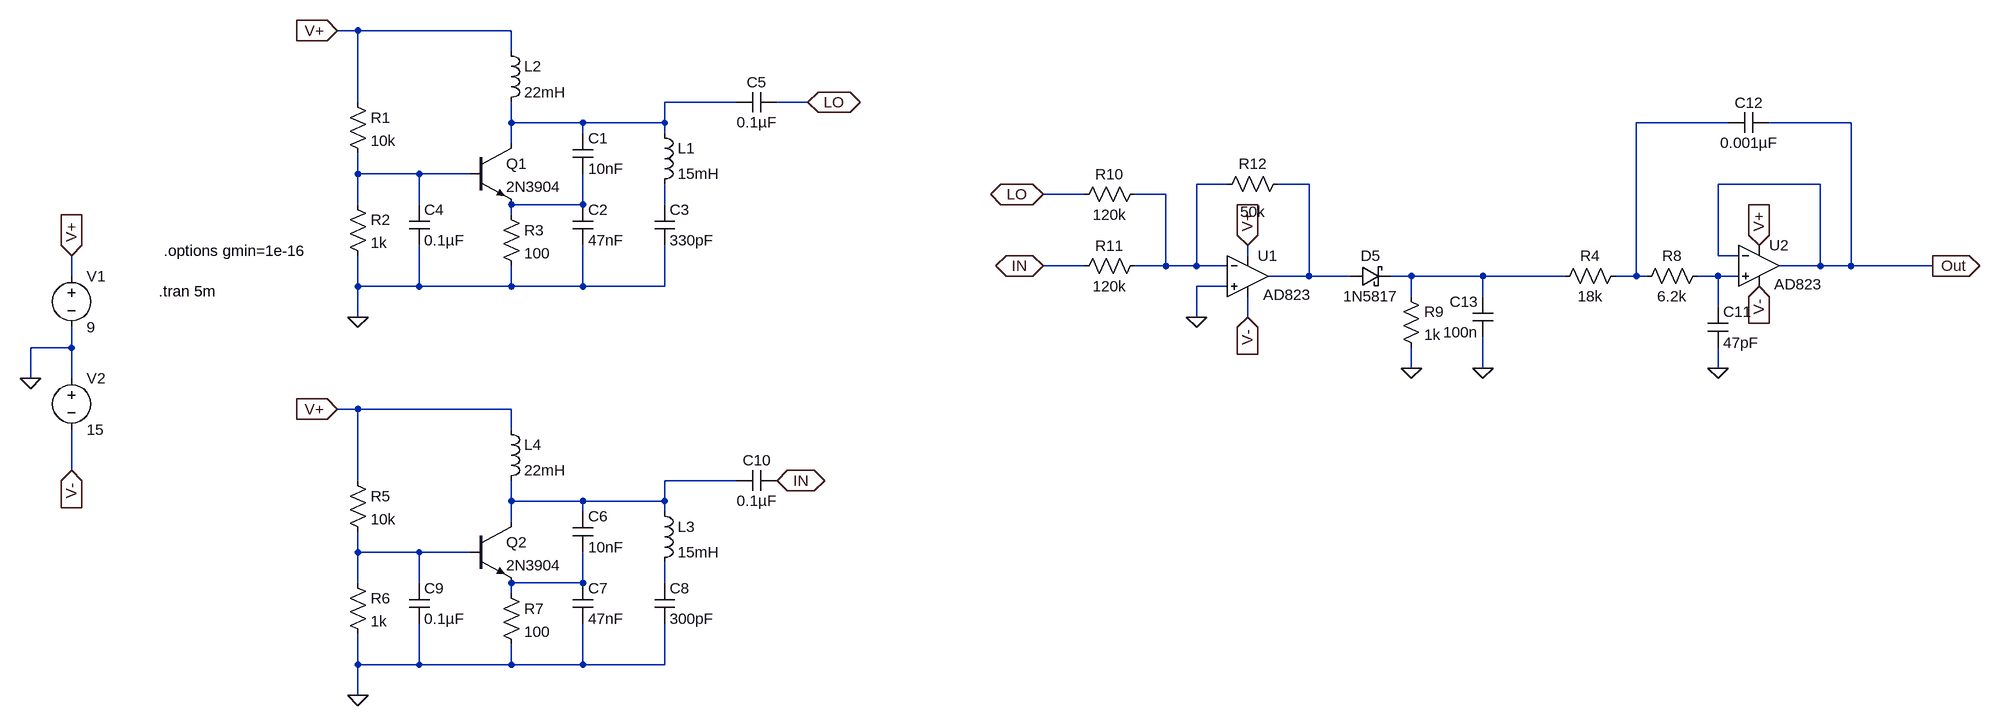
[diagram p0: schematic Draft3.asc]
Draft3.asc, the LTspice schematic file:
Version 4
SHEET 1 4036 1492
WIRE 432 64 400 64
WIRE 672 64 432 64
WIRE 672 96 672 64
WIRE 432 176 432 64
WIRE 1024 176 912 176
WIRE 1136 176 1088 176
WIRE 672 208 672 176
WIRE 784 208 672 208
WIRE 912 208 912 176
WIRE 912 208 784 208
WIRE 2576 208 2432 208
WIRE 2768 208 2640 208
WIRE 784 224 784 208
WIRE 912 224 912 208
WIRE 672 240 672 208
WIRE 432 288 432 256
WIRE 528 288 432 288
WIRE 608 288 528 288
WIRE 1792 304 1744 304
WIRE 1920 304 1872 304
WIRE 2720 304 2560 304
WIRE 1568 320 1504 320
WIRE 1696 320 1648 320
WIRE 432 336 432 288
WIRE 528 336 528 288
WIRE 784 336 784 288
WIRE 784 336 672 336
WIRE 912 336 912 304
WIRE 672 352 672 336
WIRE 1824 416 1824 400
WIRE 2560 416 2560 304
WIRE 2592 416 2560 416
WIRE 1568 432 1504 432
WIRE 1696 432 1696 320
WIRE 1696 432 1648 432
WIRE 1744 432 1744 304
WIRE 1744 432 1696 432
WIRE 1792 432 1744 432
WIRE 2720 432 2720 304
WIRE 2720 432 2656 432
WIRE 2768 432 2768 208
WIRE 2768 432 2720 432
WIRE 2896 432 2768 432
WIRE -16 448 -16 416
WIRE 1920 448 1920 304
WIRE 1920 448 1856 448
WIRE 1984 448 1920 448
WIRE 2080 448 2048 448
WIRE 2192 448 2080 448
WIRE 2320 448 2192 448
WIRE 2432 448 2432 208
WIRE 2432 448 2400 448
WIRE 2448 448 2432 448
WIRE 2560 448 2528 448
WIRE 2592 448 2560 448
WIRE 432 464 432 416
WIRE 528 464 528 400
WIRE 528 464 432 464
WIRE 672 464 672 432
WIRE 672 464 528 464
WIRE 784 464 784 400
WIRE 784 464 672 464
WIRE 912 464 912 400
WIRE 912 464 784 464
WIRE 1792 464 1744 464
WIRE 2080 480 2080 448
WIRE 2192 480 2192 448
WIRE 2560 496 2560 448
WIRE 432 512 432 464
WIRE 1744 512 1744 464
WIRE 1824 512 1824 480
WIRE -16 560 -16 528
WIRE -16 560 -80 560
WIRE 2080 592 2080 560
WIRE 2192 592 2192 544
WIRE 2560 592 2560 560
WIRE -80 608 -80 560
WIRE -16 608 -16 560
WIRE 432 656 400 656
WIRE 672 656 432 656
WIRE 672 688 672 656
WIRE -16 752 -16 688
WIRE 432 768 432 656
WIRE 1024 768 912 768
WIRE 672 800 672 768
WIRE 784 800 672 800
WIRE 912 800 912 768
WIRE 912 800 784 800
WIRE 784 816 784 800
WIRE 912 816 912 800
WIRE 672 832 672 800
WIRE 432 880 432 848
WIRE 528 880 432 880
WIRE 608 880 528 880
WIRE 432 928 432 880
WIRE 528 928 528 880
WIRE 784 928 784 880
WIRE 784 928 672 928
WIRE 912 928 912 896
WIRE 672 944 672 928
WIRE 432 1056 432 1008
WIRE 528 1056 528 992
WIRE 528 1056 432 1056
WIRE 672 1056 672 1024
WIRE 672 1056 528 1056
WIRE 784 1056 784 992
WIRE 784 1056 672 1056
WIRE 912 1056 912 992
WIRE 912 1056 784 1056
WIRE 432 1104 432 1056
FLAG 432 512 0
FLAG 432 1104 0
FLAG -16 416 V+
IOPIN -16 416 In
FLAG 400 64 V+
IOPIN 400 64 In
FLAG 400 656 V+
IOPIN 400 656 In
FLAG 1504 320 LO
IOPIN 1504 320 BiDir
FLAG 1136 176 LO
IOPIN 1136 176 BiDir
FLAG 1088 768 IN
IOPIN 1088 768 BiDir
FLAG 1504 432 IN
IOPIN 1504 432 BiDir
FLAG 2896 432 Out
IOPIN 2896 432 Out
FLAG -80 608 0
FLAG -16 752 V-
IOPIN -16 752 In
FLAG 1824 512 V-
IOPIN 1824 512 In
FLAG 1824 400 V+
IOPIN 1824 400 In
FLAG 1744 512 0
FLAG 2560 592 0
FLAG 2624 400 V+
IOPIN 2624 400 In
FLAG 2624 464 V-
IOPIN 2624 464 In
FLAG 2080 592 0
FLAG 2192 592 0
SYMBOL res 416 160 R0
SYMATTR InstName R1
SYMATTR Value 10k
SYMBOL res 416 320 R0
SYMATTR InstName R2
SYMATTR Value 1k
SYMBOL npn 608 240 R0
SYMATTR InstName Q1
SYMATTR Value 2N3904
SYMBOL res 656 336 R0
SYMATTR InstName R3
SYMATTR Value 100
SYMBOL ind 896 208 R0
SYMATTR InstName L1
SYMATTR Value 15mH
SYMBOL voltage -16 432 R0
WINDOW 123 0 0 Left 0
WINDOW 39 0 0 Left 0
SYMATTR InstName V1
SYMATTR Value 9
SYMBOL cap 768 224 R0
SYMATTR InstName C1
SYMATTR Value 10nF
SYMBOL cap 768 336 R0
SYMATTR InstName C2
SYMATTR Value 47nF
SYMBOL cap 896 336 R0
SYMATTR InstName C3
SYMATTR Value 330pF
SYMBOL cap 512 336 R0
SYMATTR InstName C4
SYMATTR Value 0.1µF
SYMBOL cap 1088 160 R90
WINDOW 0 0 32 VBottom 2
WINDOW 3 32 32 VTop 2
SYMATTR InstName C5
SYMATTR Value 0.1µF
SYMBOL res 416 752 R0
SYMATTR InstName R5
SYMATTR Value 10k
SYMBOL res 416 912 R0
SYMATTR InstName R6
SYMATTR Value 1k
SYMBOL npn 608 832 R0
SYMATTR InstName Q2
SYMATTR Value 2N3904
SYMBOL res 656 928 R0
SYMATTR InstName R7
SYMATTR Value 100
SYMBOL ind 896 800 R0
SYMATTR InstName L3
SYMATTR Value 15mH
SYMBOL ind 656 672 R0
SYMATTR InstName L4
SYMATTR Value 22mH
SYMBOL cap 768 816 R0
SYMATTR InstName C6
SYMATTR Value 10nF
SYMBOL cap 768 928 R0
SYMATTR InstName C7
SYMATTR Value 47nF
SYMBOL cap 896 928 R0
SYMATTR InstName C8
SYMATTR Value 300pF
SYMBOL cap 512 928 R0
SYMATTR InstName C9
SYMATTR Value 0.1µF
SYMBOL cap 1088 752 R90
WINDOW 0 0 32 VBottom 2
WINDOW 3 32 32 VTop 2
SYMATTR InstName C10
SYMATTR Value 0.1µF
SYMBOL ind 656 80 R0
SYMATTR InstName L2
SYMATTR Value 22mH
SYMBOL voltage -16 592 R0
WINDOW 123 0 0 Left 0
WINDOW 39 0 0 Left 0
SYMATTR InstName V2
SYMATTR Value 15
SYMBOL schottky 1984 464 R270
WINDOW 0 32 32 VTop 2
WINDOW 3 0 32 VBottom 2
SYMATTR InstName D5
SYMATTR Value 1N5817
SYMATTR Description Diode
SYMATTR Type diode
SYMBOL OpAmps\\AD823 1824 384 R0
WINDOW 3 24 93 Left 2
SYMATTR InstName U1
SYMBOL res 1664 304 R90
WINDOW 0 0 56 VBottom 2
WINDOW 3 32 56 VTop 2
SYMATTR InstName R10
SYMATTR Value 120k
SYMBOL res 1664 416 R90
WINDOW 0 0 56 VBottom 2
WINDOW 3 32 56 VTop 2
SYMATTR InstName R11
SYMATTR Value 120k
SYMBOL res 1888 288 R90
WINDOW 0 0 56 VBottom 2
WINDOW 3 44 56 VTop 2
SYMATTR InstName R12
SYMATTR Value 50k
SYMBOL res 2416 432 R90
WINDOW 0 0 56 VBottom 2
WINDOW 3 32 56 VTop 2
SYMATTR InstName R4
SYMATTR Value 18k
SYMBOL res 2544 432 R90
WINDOW 0 0 56 VBottom 2
WINDOW 3 32 56 VTop 2
SYMATTR InstName R8
SYMATTR Value 6.2k
SYMBOL OpAmps\\AD823 2624 368 R0
WINDOW 3 24 93 Left 2
SYMATTR InstName U2
SYMBOL cap 2544 496 R0
SYMATTR InstName C11
SYMATTR Value 47pF
SYMBOL res 2064 464 R0
SYMATTR InstName R9
SYMATTR Value 1k
SYMBOL cap 2640 192 R90
WINDOW 0 0 32 VBottom 2
WINDOW 3 32 32 VTop 2
SYMATTR InstName C12
SYMATTR Value 0.001µF
SYMBOL cap 2208 544 R180
WINDOW 0 24 56 Left 2
WINDOW 3 24 8 Left 2
SYMATTR InstName C13
SYMATTR Value 100n
TEXT 120 472 Left 2 !.tran 5m
TEXT 128 408 Left 2 !.options gmin=1e-16

The netlist it stands for:
* Draft3.asc
R1 V+ N003 10k
R2 N003 0 1k
Q1 N001 N003 N006 0 2N3904
R3 N006 0 100
L1 N001 N007 15mH
V1 V+ 0 9
C1 N001 N006 10nF
C2 N006 0 47nF
C3 N007 0 330pF
C4 N003 0 0.1µF
C5 LO N001 0.1µF
R5 V+ N011 10k
R6 N011 0 1k
Q2 N010 N011 N012 0 2N3904
R7 N012 0 100
L3 N010 N013 15mH
L4 V+ N010 22mH
C6 N010 N012 10nF
C7 N012 0 47nF
C8 N013 0 300pF
C9 N011 0 0.1µF
C10 IN N010 0.1µF
L2 V+ N001 22mH
V2 0 V- 15
D5 N005 N008 1N5817
XU1 0 N004 V+ V- N005 AD823  ; pins In+ In- V+ V- OUT
R10 N004 LO 120k
R11 N004 IN 120k
R12 N005 N004 50k
R4 N002 N008 18k
R8 N009 N002 6.2k
XU2 N009 Out V+ V- Out AD823  ; pins In+ In- V+ V- OUT
C11 N009 0 47pF
R9 N008 0 1k
C12 Out N002 0.001µF
C13 0 N008 100n
.model D D
.lib standard.dio
.model NPN NPN
.model PNP PNP
.lib standard.bjt
.tran 5m
.options gmin=1e-16
.lib ADI.lib
.backanno
.end